# Altium schematic sheet Jade_v1_schematics_PG4_AUX_PARTS.SchDoc
size A4; Author: Hanxiao; Revision: A0_Alpha; SheetNumber: 4; SheetTotal: 4
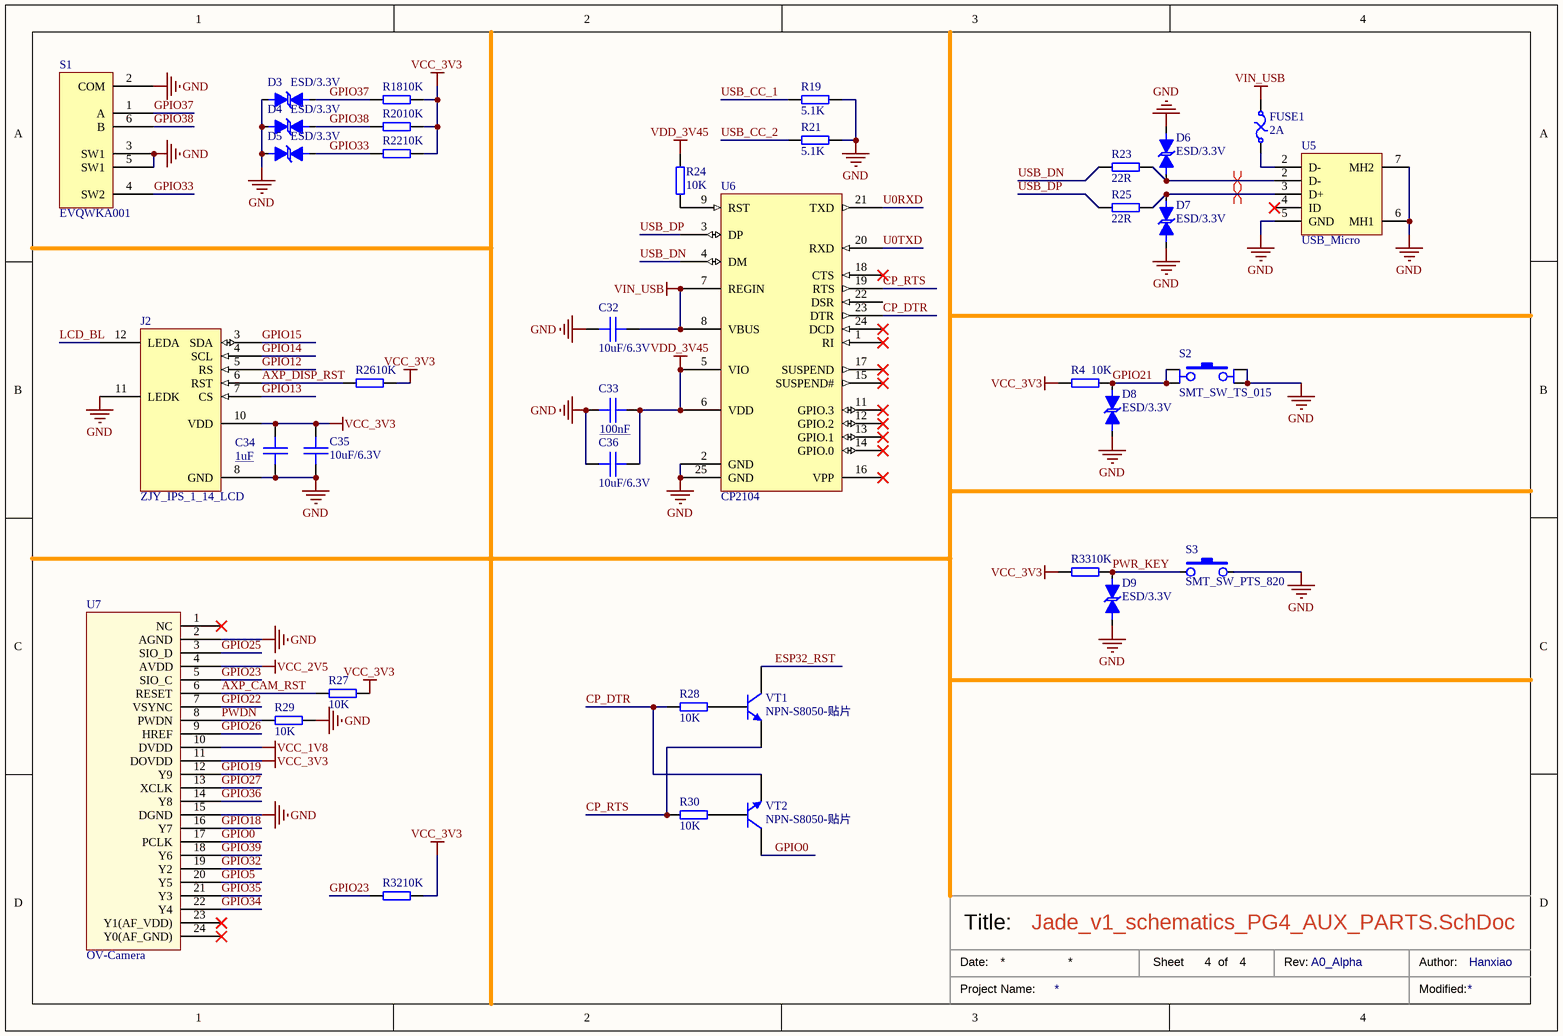
[diagram p0: Jade_v1_schematics_PG4_AUX_PARTS.SchDoc]

## Parts
C32  10uF/6.3V  [SMT_C_0603]
C33  100nF  [SMT_C_0402]
C34  1uF  [SMT_C_0402]
C35  10uF/6.3V  [SMT_C_0603]
C36  10uF/6.3V  [SMT_C_0603]
D3  ESD/3.3V  [SMT_DIODE_SOD_523]
D4  ESD/3.3V  [SMT_DIODE_SOD_523]
D5  ESD/3.3V  [SMT_DIODE_SOD_523]
D6  ESD/3.3V  [SMT_DIODE_SOD_523]
D7  ESD/3.3V  [SMT_DIODE_SOD_523]
D8  ESD/3.3V  [SMT_DIODE_SOD_523]
D9  ESD/3.3V  [SMT_DIODE_SOD_523]
FUSE1  2A  [SMT_FUSE_0805]
J2  ZJY_IPS_1_14_LCD  [ZJY_1.3_HZ_13Pin]
R4  10K  [SMT_R_0402]
R18  10K  [SMT_R_0402]
R19  5.1K  [SMT_R_0402]
R20  10K  [SMT_R_0402]
R21  5.1K  [SMT_R_0402]
R22  10K  [SMT_R_0402]
R23  22R  [SMT_R_0402]
R24  10K  [SMT_R_0402]
R25  22R  [SMT_R_0402]
R26  10K  [SMT_R_0402]
R27  10K  [SMT_R_0402]
R28  10K  [SMT_R_0402]
R29  10K  [SMT_R_0402]
R30  10K  [SMT_R_0402]
R32  10K  [SMT_R_0402]
R33  10K  [SMT_R_0402]
S1  EVQWKA001  [EVQWKA001]
S2  SMT_SW_TS_015  [SMT_SW_TS_015]
S3  SMT_SW_PTS_820  [SMT_SW_PTS_820]
U5  USB_Micro  [M5-USB-TC-2]
U6  CP2104  [QFN50P401X400X90_HS-25N]
U7  OV-Camera  [FPC0.5-SMT-24P-B-DRAWER]
VT1  NPN-S8050-贴片  [NPN-S8050-贴片]
VT2  NPN-S8050-贴片  [NPN-S8050-贴片]

## Nets
GND: C32.1 C33.1 C34.1 C35.2 C36.1 D3.2(K) D4.2(K) D5.2(K) D6.1(A) D7.2(K) D8.2(K) D9.2(K) J2.8(GND) J2.11(LEDK) R19.1 R21.1 R29.2 S1.2(COM) S1.3(SW1) S1.5(SW1) S2.3(PINB1) S2.4(PINB2) S3.2 U5.5(GND) U5.6(MH1) U5.7(MH2) U6.2(GND) U6.25(GND) U7.2(AGND) U7.15(DGND)
VCC_1V8: U7.10(DVDD)
VCC_2V5: U7.4(AVDD)
VCC_3V3: C34.2 C35.1 J2.10(VDD) R4.1 R18.2 R20.2 R22.2 R26.2 R27.2 R32.2 R33.1 U7.11(DOVDD)
VDD_3V45: C33.2 C36.2 R24.1 U6.5(VIO) U6.6(VDD)
VIN_USB: C32.2 FUSE1.2 U6.7(REGIN) U6.8(VBUS)
AXP_CAM_RST: R27.1 U7.6(RESET)
AXP_DISP_RST: J2.6(RST) R26.1
CP_DTR: R28.2 U6.23(DTR) VT2.2(E)
CP_RTS: R30.2 U6.19(RTS) VT1.2(E)
ESP32_RST: VT1.3(C)
GPIO0: U7.17(PCLK) VT2.3(C)
GPIO5: U7.20(Y5)
GPIO12: J2.5(RS)
GPIO13: J2.7(CS)
GPIO14: J2.4(SCL)
GPIO15: J2.3(SDA)
GPIO18: U7.16(Y7)
GPIO19: U7.12(Y9)
GPIO21: D8.1(A) R4.2 S2.1(PINA1) S2.2(PINA2)
GPIO22: U7.7(VSYNC)
GPIO23: R32.1 U7.5(SIO_C)
GPIO25: U7.3(SIO_D)
GPIO26: U7.9(HREF)
GPIO27: U7.13(XCLK)
GPIO32: U7.19(Y2)
GPIO33: D5.1(A) R22.1 S1.4(SW2)
GPIO34: U7.22(Y4)
GPIO35: U7.21(Y3)
GPIO36: U7.14(Y8)
GPIO37: D3.1(A) R18.1 S1.1(A)
GPIO38: D4.1(A) R20.1 S1.6(B)
GPIO39: U7.18(Y6)
LCD_BL: J2.12(LEDA)
PWDN: R29.1 U7.8(PWDN)
PWR_KEY: D9.1(A) R33.2 S3.1
U0RXD: U6.21(TXD)
U0TXD: U6.20(RXD)
USB_CC_1: R19.2
USB_CC_2: R21.2
USB_DN: R23.2 U6.4(DM)
USB_DP: R25.2 U6.3(DP)
NetD6_2: D6.2(K) R23.1 U5.2(D-)
NetD7_1: D7.1(A) R25.1 U5.3(D+)
NetFUSE1_1: FUSE1.1 U5.2(D-)
NetR24_2: R24.2 U6.9(RST)
NetR28_1: R28.1 VT1.1(B)
NetR30_1: R30.1 VT2.1(B)

Not connected (* = marked no-connect by the designer): U5 4(ID)*; U6 1(RI)* 11(GPIO.3)* 12(GPIO.2)* 13(GPIO.1)* 14(GPIO.0)* 15(SUSPEND#)* 16(VPP)* 17(SUSPEND)* 18(CTS)* 22(DSR) 24(DCD)*; U7 1(NC)* 23(Y1(AF_VDD))* 24(Y0(AF_GND))*

## Layout directives
differential pair: NetD6_2, NetD7_1

## Notes on the sheet
- Date:
- Title:
- Sheet
- of
- Rev:
- Author:
- Project Name:
- Modified:
- Labels drawn without touching a wire or pin: DSR, DTR, GND

## Library data of the parts
C32 C35 C36 = SMT_C_0603: Surface mount capacitor 0603
C33 C34 = SMT_C_0402: Surface mount capacitor 0402
D3-D9 = SMT_DIODE_TVS_B_SOD_523: Surface mount bidirectional TVS diode SOD-523(0603) Package
FUSE1 = SMT_FUSE_1812
R4 R18-R22 R24 R26-R30 R32 R33 = SMT_R_0402: Surface mount resistor 0402
R23 R25 = SMT_R_0603: Surface mount resistor 0603
S3 = SMT_SW_PTS_820: SMT Tactile ‎Switch PTS 820 Series
U5 = USB_Micro: USB micro female
U6 = CP2104: 单芯片USB转UART桥接器
U7 = OV-Camera: OV9650/OV2460/OV3640/OV5640